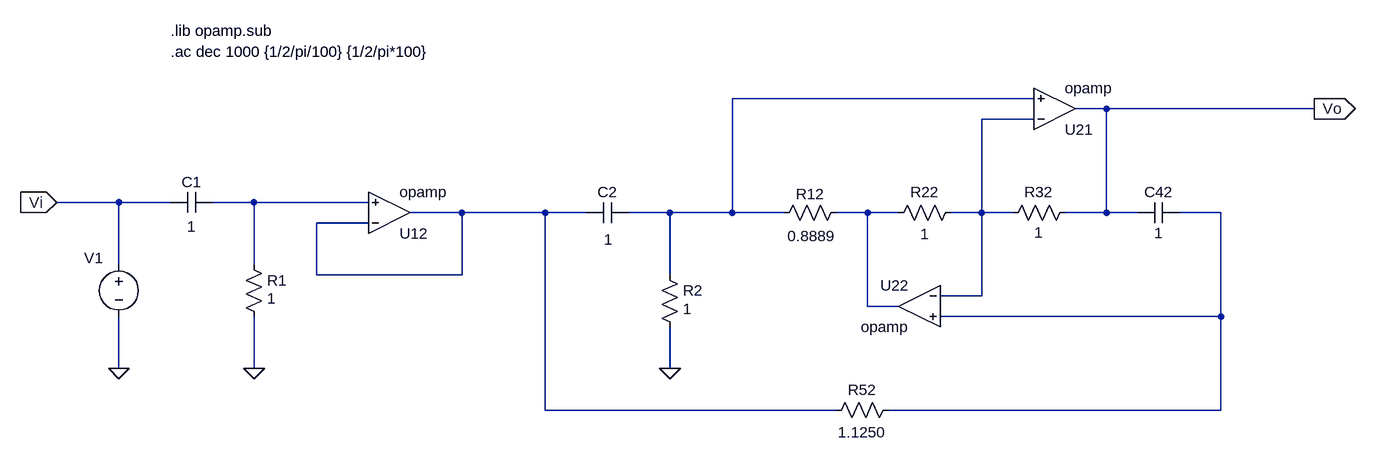
[diagram p0: schematic TS6_LTSpice_Circuito_Sugerido.asc]
TS6_LTSpice_Circuito_Sugerido.asc, the LTspice schematic file:
Version 4
SHEET 1 936 680
WIRE 288 -128 -176 -128
WIRE 400 -112 352 -112
WIRE 720 -112 400 -112
WIRE 288 -96 208 -96
WIRE -1120 32 -1216 32
WIRE -1040 32 -1120 32
WIRE -912 32 -976 32
WIRE -736 32 -912 32
WIRE -592 48 -672 48
WIRE -464 48 -592 48
WIRE -400 48 -464 48
WIRE -272 48 -336 48
WIRE -176 48 -176 -128
WIRE -176 48 -272 48
WIRE -96 48 -176 48
WIRE 32 48 -16 48
WIRE 80 48 32 48
WIRE 208 48 208 -96
WIRE 208 48 160 48
WIRE 256 48 208 48
WIRE 400 48 400 -112
WIRE 400 48 336 48
WIRE 448 48 400 48
WIRE 576 48 512 48
WIRE -736 64 -816 64
WIRE -1120 128 -1120 32
WIRE -912 128 -912 32
WIRE -816 144 -816 64
WIRE -592 144 -592 48
WIRE -592 144 -816 144
WIRE -272 144 -272 48
WIRE 208 176 208 48
WIRE 208 176 144 176
WIRE 32 192 32 48
WIRE 80 192 32 192
WIRE 576 208 576 48
WIRE 576 208 144 208
WIRE -1120 288 -1120 208
WIRE -912 288 -912 208
WIRE -272 288 -272 224
WIRE -464 352 -464 48
WIRE -16 352 -464 352
WIRE 576 352 576 208
WIRE 576 352 64 352
FLAG -272 288 0
FLAG -1120 288 0
FLAG -912 288 0
FLAG 720 -112 Vo
IOPIN 720 -112 Out
FLAG -1216 32 Vi
IOPIN -1216 32 In
SYMBOL res -288 128 R0
WINDOW 3 36 68 Left 2
SYMATTR InstName R2
SYMATTR Value 1
SYMBOL res 0 32 R90
WINDOW 0 -13 56 VCenter 2
WINDOW 3 52 54 VCenter 2
SYMATTR InstName R12
SYMATTR Value 0.8889
SYMBOL res 176 32 R90
WINDOW 0 0 56 VBottom 2
WINDOW 3 64 56 VBottom 2
SYMATTR InstName R22
SYMATTR Value 1
SYMBOL res 352 32 R90
WINDOW 0 0 56 VBottom 2
WINDOW 3 62 56 VBottom 2
SYMATTR InstName R32
SYMATTR Value 1
SYMBOL res 80 336 R90
WINDOW 0 0 56 VBottom 2
WINDOW 3 66 56 VBottom 2
SYMATTR InstName R52
SYMATTR Value 1.1250
SYMBOL cap -336 32 R90
WINDOW 0 0 32 VBottom 2
WINDOW 3 73 31 VBottom 2
SYMATTR InstName C2
SYMATTR Value 1
SYMATTR SpiceLine Rser=0
SYMBOL cap 512 32 R90
WINDOW 0 0 32 VBottom 2
WINDOW 3 63 32 VBottom 2
SYMATTR InstName C42
SYMATTR Value 1
SYMATTR SpiceLine Rser=0
SYMBOL OpAmps\\opamp 112 128 M0
SYMATTR InstName U22
SYMBOL OpAmps\\opamp 320 -48 M180
SYMATTR InstName U21
SYMBOL voltage -1120 112 R0
WINDOW 0 -24 6 Right 2
WINDOW 3 24 96 Invisible 2
SYMATTR Value2 AC 1 0
SYMATTR SpiceLine Rser=0
SYMATTR InstName V1
SYMATTR Value ""
SYMBOL OpAmps\\opamp -704 112 M180
SYMATTR InstName U12
SYMBOL cap -976 16 R90
WINDOW 0 0 32 VBottom 2
WINDOW 3 69 32 VBottom 2
SYMATTR InstName C1
SYMATTR Value 1
SYMATTR SpiceLine Rser=0
SYMBOL res -928 112 R0
WINDOW 3 36 68 Left 2
SYMATTR InstName R1
SYMATTR Value 1
TEXT -1040 -232 Left 2 !.lib opamp.sub
TEXT -1040 -200 Left 2 !.ac dec 1000 {1/2/pi/100} {1/2/pi*100}

The netlist it stands for:
* TS6_LTSpice_Circuito_Sugerido.asc
R2 N001 0 1
R12 N005 N001 0.8889
R22 N002 N005 1
R32 Vo N002 1
R52 N006 N004 1.1250
C2 N001 N004 1 Rser=0
C42 N006 Vo 1 Rser=0
XU22 N002 N006 N005 opamp Aol=100K GBW=10Meg  ; pins invin noninvin out
XU21 N002 N001 Vo opamp Aol=100K GBW=10Meg  ; pins invin noninvin out
V1 Vi 0 AC 1 0 Rser=0
XU12 N004 N003 N004 opamp Aol=100K GBW=10Meg  ; pins invin noninvin out
C1 N003 Vi 1 Rser=0
R1 N003 0 1
.lib opamp.sub
.ac dec 1000 {1/2/pi/100} {1/2/pi*100}
.backanno
.end